# EAGLE design IOIO (EAGLE 6.3)
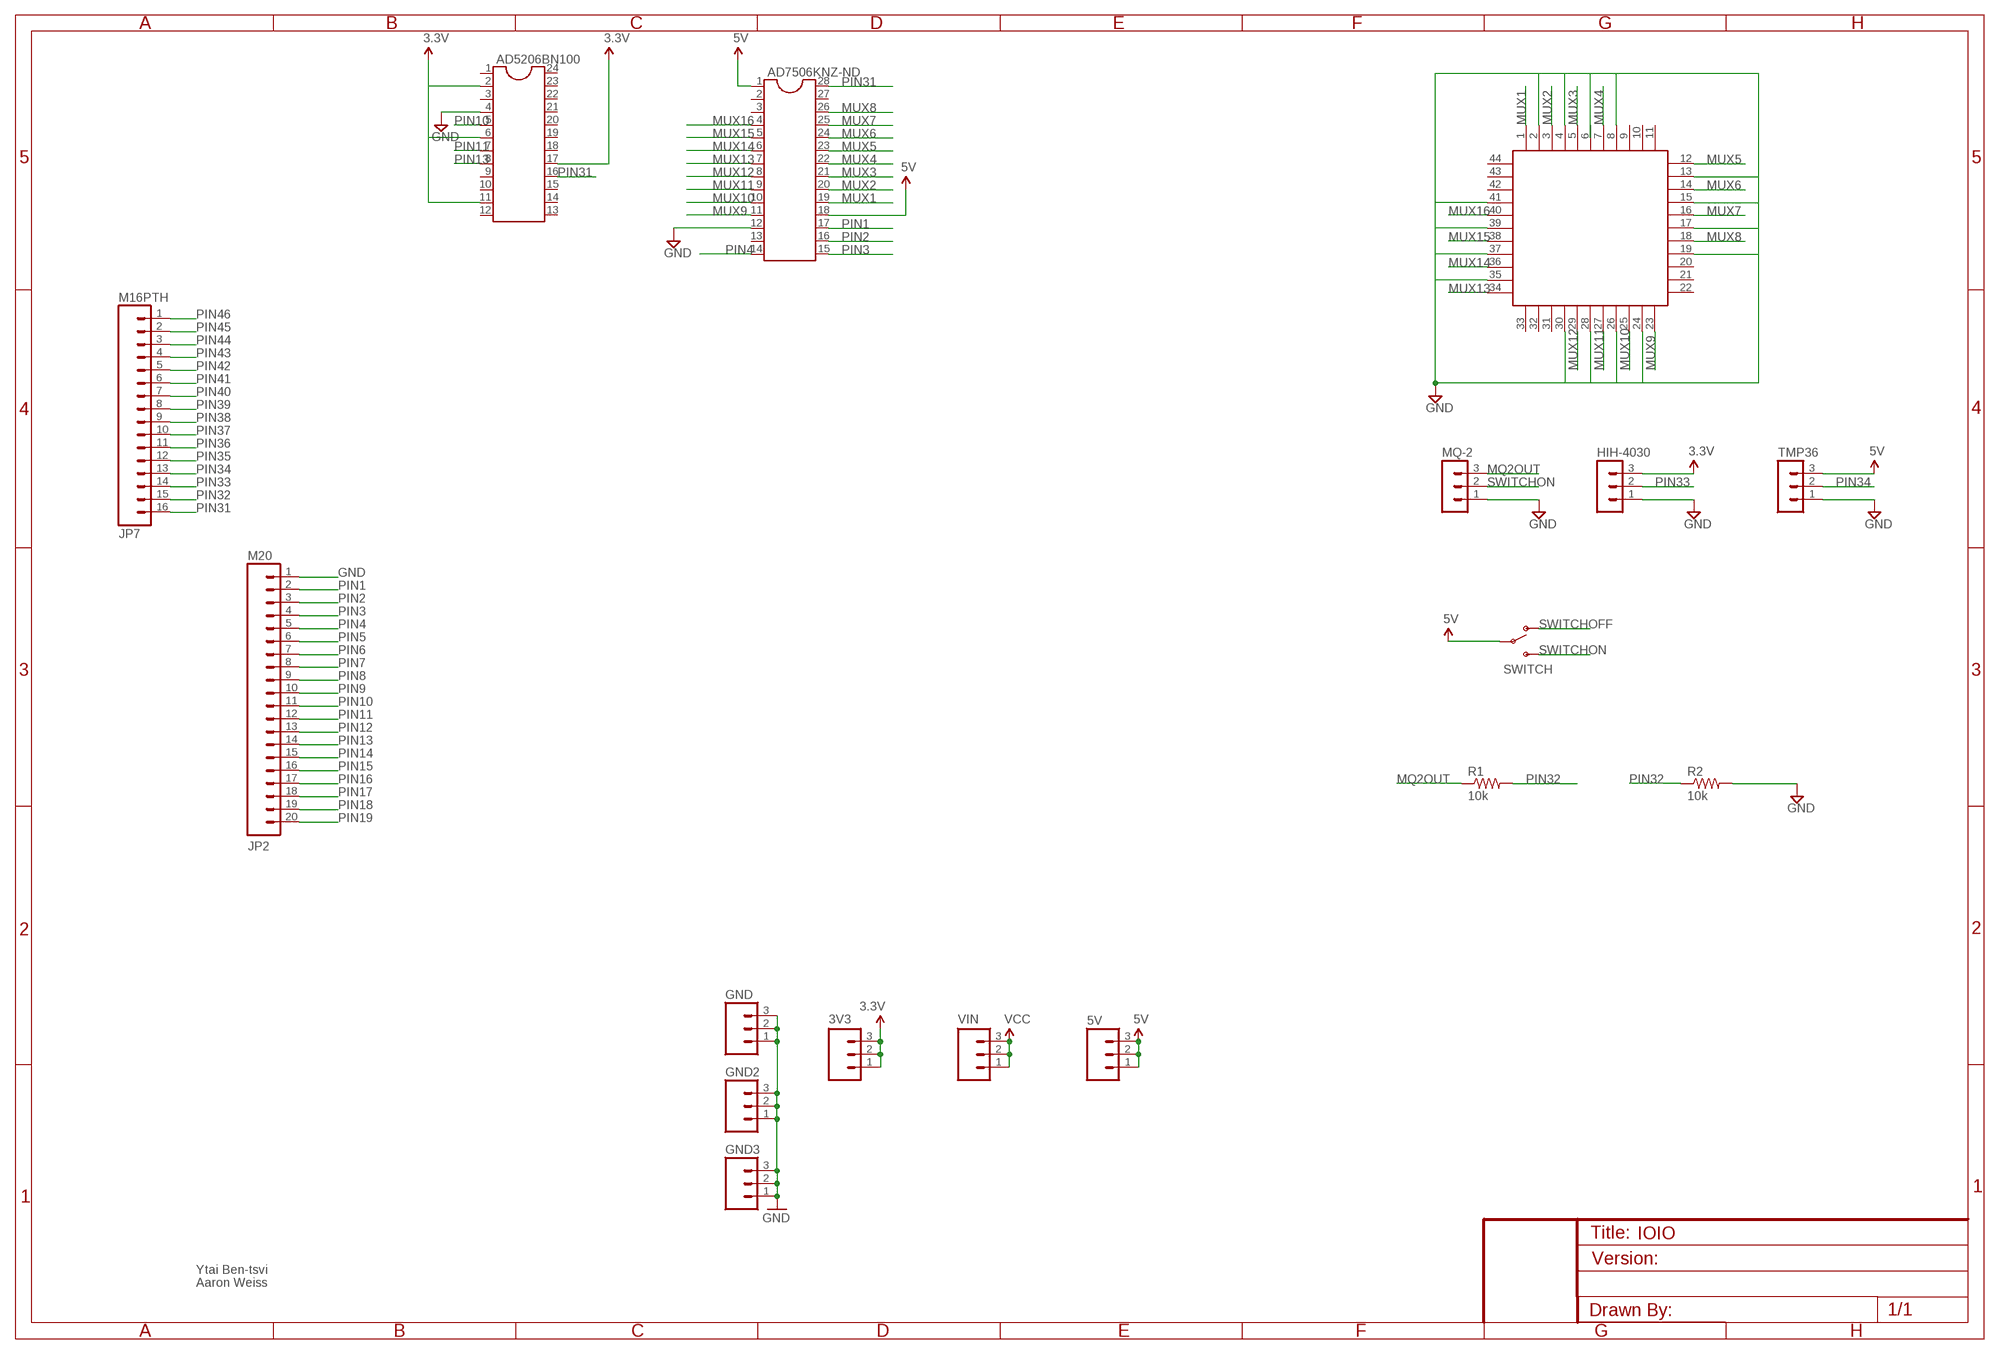
[diagram p0: schematic, sheet 1]

## Parts
3V3  M03PTH  [1X03]
5V  M03PTH  [1X03]
AD5206BN100  DIL24-3  [DIL24-3]
AD7506KNZ-ND  DIL28  [DIL28-6]
GND  M03PTH  [1X03]
GND2  M03PTH  [1X03]
GND3  M03PTH  [1X03]
HIH-4030  MA03-1  [MA03-1]
JP2  M20  [1X20]
JP7  M16PTH  [1X16]
MQ-2  MA03-1  [MA03-1]
R1  10k  R-US_0207/7  [0207/7]
R2  10k  R-US_0207/7  [0207/7]
SWITCH  SWITCH-SPSTPTH  [SWITCH-SPDT]
TMP36  MA03-1  [MA03-1]
U$1  S44  [S44]
VIN  M03PTH  [1X03]

## Nets
3.3V: 3V3.1 3V3.2 3V3.3 AD5206BN100.2 AD5206BN100.6 AD5206BN100.11 AD5206BN100.17 HIH-4030.3
5V: 5V.1 5V.2 5V.3 AD7506KNZ-ND.1 AD7506KNZ-ND.18 SWITCH.2(P) TMP36.3
GND: AD5206BN100.4 AD7506KNZ-ND.12 GND2.1 GND2.2 GND2.3 GND3.1 GND3.2 GND3.3 GND.1 GND.2 GND.3 HIH-4030.1 JP2.1 MQ-2.1 R2.2 TMP36.1 U$1.2 U$1.4 U$1.8 U$1.13 U$1.15 U$1.17 U$1.19 U$1.24 U$1.26 U$1.28 U$1.30 U$1.35 U$1.37 U$1.39 U$1.41
MQ2OUT: MQ-2.3 R1.1
MUX1: AD7506KNZ-ND.19 U$1.1
MUX2: AD7506KNZ-ND.20 U$1.3
MUX3: AD7506KNZ-ND.21 U$1.5
MUX4: AD7506KNZ-ND.22 U$1.7
MUX5: AD7506KNZ-ND.23 U$1.12
MUX6: AD7506KNZ-ND.24 U$1.14
MUX7: AD7506KNZ-ND.25 U$1.16
MUX8: AD7506KNZ-ND.26 U$1.18
MUX9: AD7506KNZ-ND.11 U$1.23
MUX10: AD7506KNZ-ND.10 U$1.25
MUX11: AD7506KNZ-ND.9 U$1.27
MUX12: AD7506KNZ-ND.8 U$1.29
MUX13: AD7506KNZ-ND.7 U$1.34
MUX14: AD7506KNZ-ND.6 U$1.36
MUX15: AD7506KNZ-ND.5 U$1.38
MUX16: AD7506KNZ-ND.4 U$1.40
PIN1: AD7506KNZ-ND.17 JP2.2
PIN2: AD7506KNZ-ND.16 JP2.3
PIN3: AD7506KNZ-ND.15 JP2.4
PIN4: AD7506KNZ-ND.14 JP2.5
PIN5: JP2.6
PIN6: JP2.7
PIN7: JP2.8
PIN8: JP2.9
PIN9: JP2.10
PIN10: AD5206BN100.5 JP2.11
PIN11: AD5206BN100.7 JP2.12
PIN12: JP2.13
PIN13: AD5206BN100.8 JP2.14
PIN14: JP2.15
PIN15: JP2.16
PIN16: JP2.17
PIN17: JP2.18
PIN18: JP2.19
PIN19: JP2.20
PIN31: AD5206BN100.16 AD7506KNZ-ND.28 JP7.16
PIN32: JP7.15 R1.2 R2.1
PIN33: HIH-4030.2 JP7.14
PIN34: JP7.13 TMP36.2
PIN35: JP7.12
PIN36: JP7.11
PIN37: JP7.10
PIN38: JP7.9
PIN39: JP7.8
PIN40: JP7.7
PIN41: JP7.6
PIN42: JP7.5
PIN43: JP7.4
PIN44: JP7.3
PIN45: JP7.2
PIN46: JP7.1
SWITCHOFF: SWITCH.1(O)
SWITCHON: MQ-2.2 SWITCH.3(S)
VCC: VIN.1 VIN.2 VIN.3
Unconnected: AD5206BN100.1 AD5206BN100.3 AD5206BN100.9 AD5206BN100.10 AD5206BN100.12 AD5206BN100.13 AD5206BN100.14 AD5206BN100.15 AD5206BN100.18 AD5206BN100.19 AD5206BN100.20 AD5206BN100.21 AD5206BN100.22 AD5206BN100.23 AD5206BN100.24 AD7506KNZ-ND.2 AD7506KNZ-ND.3 AD7506KNZ-ND.13 AD7506KNZ-ND.27 U$1.6 U$1.9 U$1.10 U$1.11 U$1.20 U$1.21 U$1.22 U$1.31 U$1.32 U$1.33 U$1.42 U$1.43 U$1.44

## Notes on the sheet
- Ytai Ben-tsvi
- Aaron Weiss

## Library data of the parts
3V3 5V GND GND2 GND3 VIN = SparkFun:M03: Header 3 Standard 3-pin 0.1" header. Use with straight break away headers (SKU : PRT-00116), right angle break away headers (PRT-00553), swiss pins (PRT-00743), machine pins (PRT-00117), and female headers (PRT-00115). Molex polarized connector foot print use with SKU : PRT-08232 with associated crimp pins and housings.
AD5206BN100 = ic-package:DIL24: Dual In Line
AD7506KNZ-ND = ic-package:DIL28: Dual In Line
HIH-4030 MQ-2 TMP36 = con-lstb:MA03-1: PIN HEADER; OC_FARNELL: unknown; OC_NEWARK: unknown
JP2 = SparkFun-Connectors:M20: 1x20 .1" header This is just like the LOCK variant in that the holes are staggared by 5 mil, but except for the last two holes. They are not altered from the "standard" footprint layout. This is used for a special purpose on the layout of our Graphic LCD Backpack. Make sure you want to use this device before selecting it for you project!
JP7 = SparkFun-Connectors:M16: 1x16 .1" header
R1 R2 = rcl:R-US_: RESISTOR, American symbol
SWITCH = SparkFun:SWITCH-SPST: SPST Switch Simple slide switch. Spark Fun Electronics SKU : COM-00102
U$1 = plcc-socket:S44: 44-pin PLCC through-hole socket

## Board
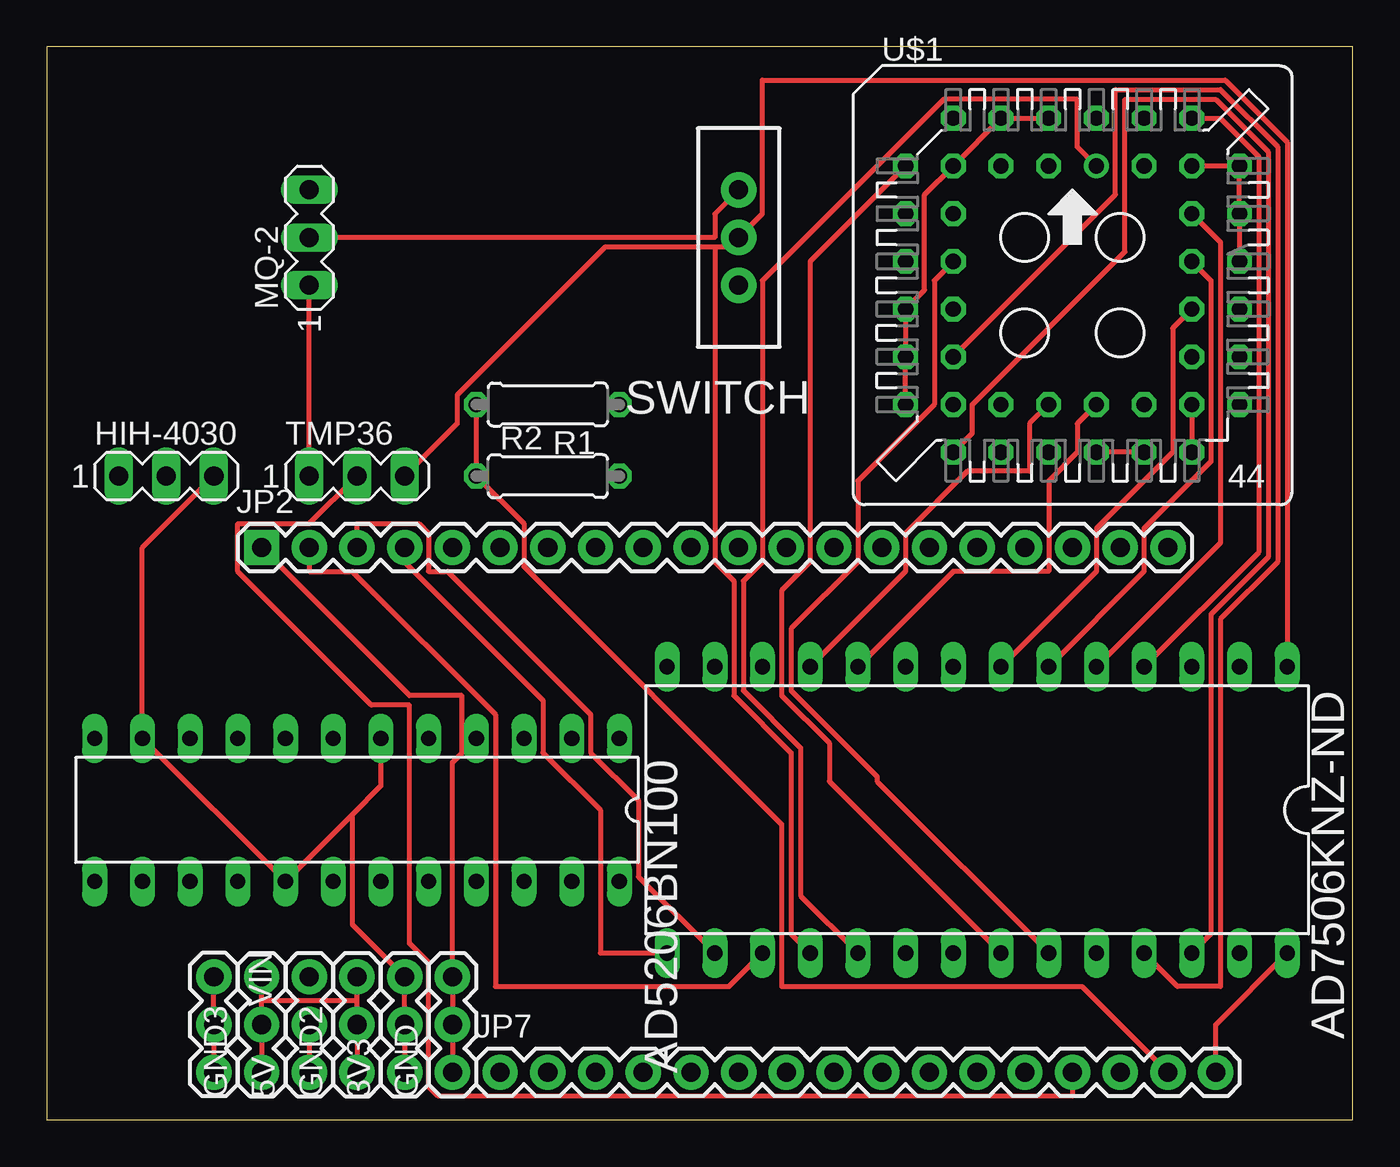
[diagram p1: board, top side]
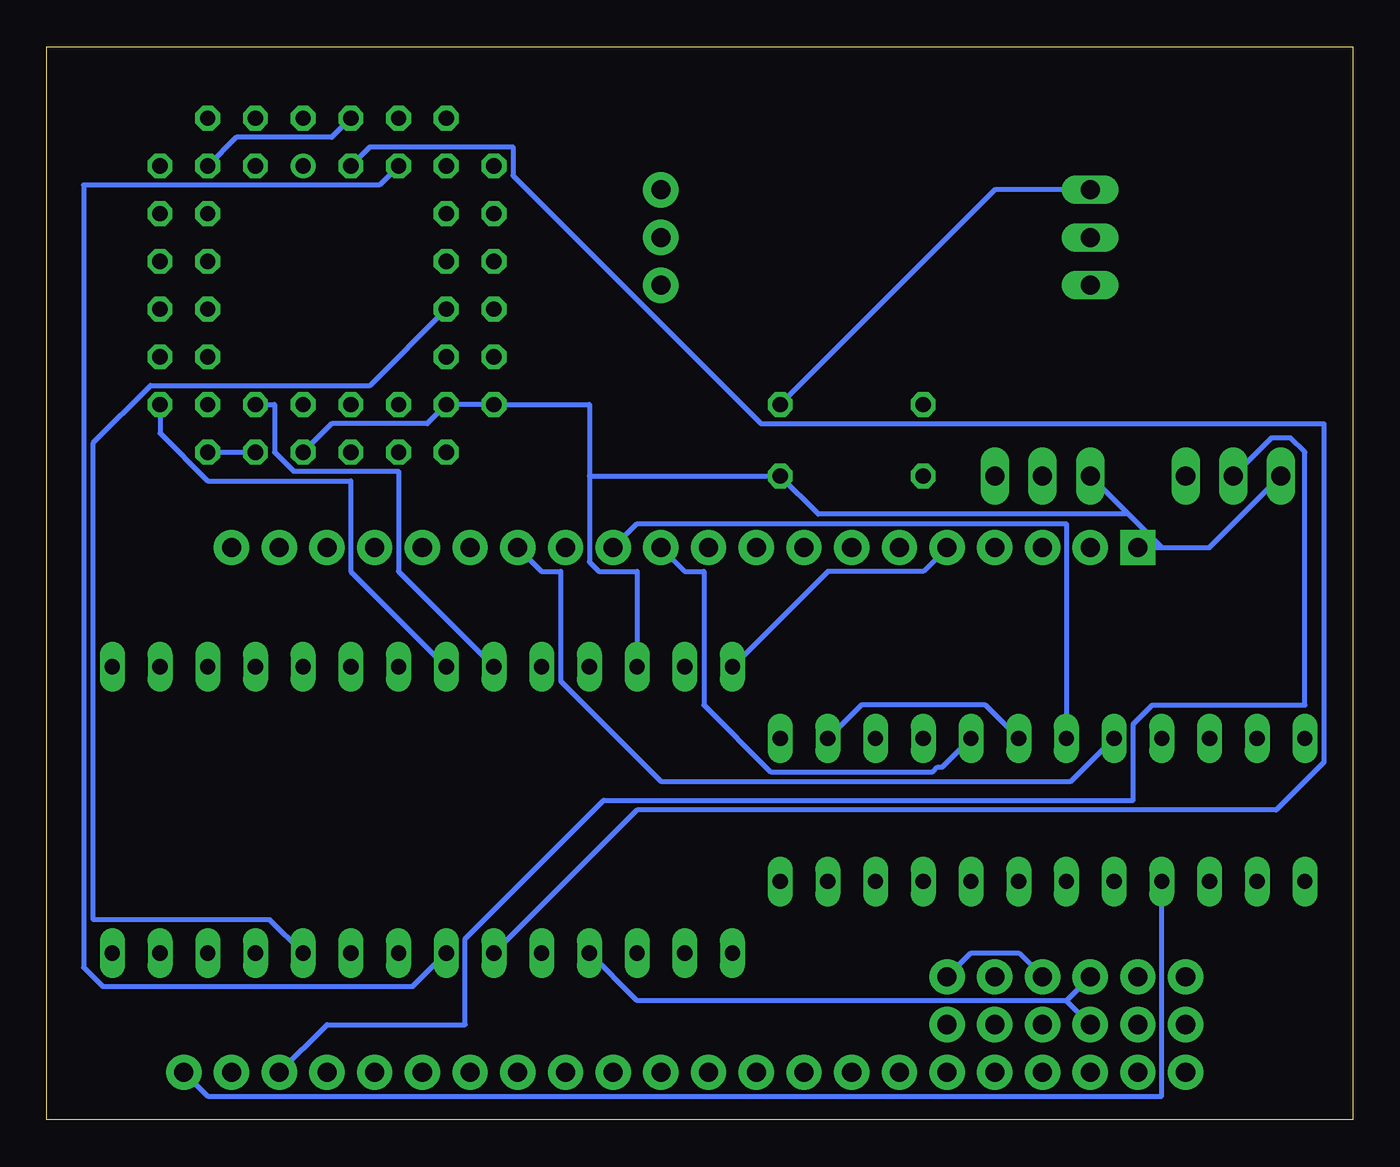
[diagram p2: board, bottom side, seen from below]

Size 69.52 x 57.14 mm. Coordinates in mm from the lower left corner, seen from the top.
Outline: 0,0 69.52,0 69.52,57.14 0,57.14 0,0
Copper layers (1*16): Top 0.035mm / dielectric 1.5mm / Bottom 0.035mm
Design rules "default": minimum track width 10mil, minimum drill 24mil, track to track 8mil, track to pad 8mil, pad to pad 8mil, via to via 8mil, smd to smd 8mil, copper to edge 40mil, drill to drill 8mil, minimum pad ring 10mil, minimum via ring 8mil, stop-mask expansion 4mil, vias tented up to drill 0mil, thermal gap 10mil

### Footprints (pad centres in the part's own frame; a part is rotated, then mirrored left to right if it is on the bottom)
1X03 = drill 1.016 pad 1.88: 1 0,0; 2 2.54,0; 3 5.08,0
DIL24-3 = drill 0.813 long: 1 -13.97,-3.81; 2 -11.43,-3.81; 3 -8.89,-3.81; 4 -6.35,-3.81; 5 -3.81,-3.81; 6 -1.27,-3.81; 7 1.27,-3.81; 8 3.81,-3.81; 9 6.35,-3.81; 10 8.89,-3.81; 11 11.43,-3.81; 12 13.97,-3.81; 13 13.97,3.81; 14 11.43,3.81; 15 8.89,3.81; 16 6.35,3.81; 17 3.81,3.81; 18 1.27,3.81; 19 -1.27,3.81; 20 -3.81,3.81; 21 -6.35,3.81; 22 -8.89,3.81; 23 -11.43,3.81; 24 -13.97,3.81
DIL28-6 = drill 0.813 long: 1 -16.51,-7.62; 2 -13.97,-7.62; 3 -11.43,-7.62; 4 -8.89,-7.62; 5 -6.35,-7.62; 6 -3.81,-7.62; 7 -1.27,-7.62; 8 1.27,-7.62; 9 3.81,-7.62; 10 6.35,-7.62; 11 8.89,-7.62; 12 11.43,-7.62; 13 13.97,-7.62; 14 16.51,-7.62; 15 16.51,7.62; 16 13.97,7.62; 17 11.43,7.62; 18 8.89,7.62; 19 6.35,7.62; 20 3.81,7.62; 21 1.27,7.62; 22 -1.27,7.62; 23 -3.81,7.62; 24 -6.35,7.62; 25 -8.89,7.62; 26 -11.43,7.62; 27 -13.97,7.62; 28 -16.51,7.62
MA03-1 = drill 1.016 long: 1 -2.54,0; 2 0,0; 3 2.54,0
1X20 = drill 1.016 pad 1.88 square: 1 0,0 | drill 1.016 pad 1.88: 2 2.54,0; 3 5.08,0; 4 7.62,0; 5 10.16,0; 6 12.7,0; 7 15.24,0; 8 17.78,0; 9 20.32,0; 10 22.86,0; 11 25.4,0; 12 27.94,0; 13 30.48,0; 14 33.02,0; 15 35.56,0; 16 38.1,0; 17 40.64,0; 18 43.18,0; 19 45.72,0; 20 48.26,0
1X16 = drill 1.016 pad 1.88: 1 0,0; 2 2.54,0; 3 5.08,0; 4 7.62,0; 5 10.16,0; 6 12.7,0; 7 15.24,0; 8 17.78,0; 9 20.32,0; 10 22.86,0; 11 25.4,0; 12 27.94,0; 13 30.48,0; 14 33.02,0; 15 35.56,0; 16 38.1,0
0207/7 = drill 0.813 octagon: 1 -3.81,0; 2 3.81,0
SWITCH-SPDT = drill 1.016 pad 1.88: 1 0,2.54; 2 0,0; 3 0,-2.54
S44 = drill 0.813: 1 1.27,6.35 | drill 0.813 octagon: 2 -1.27,8.89; 3 -1.27,6.35; 4 -3.81,8.89; 5 -3.81,6.35; 6 -6.35,8.89; 7 -8.89,6.35; 8 -6.35,6.35; 9 -8.89,3.81; 10 -6.35,3.81; 11 -8.89,1.27; 12 -6.35,1.27; 13 -8.89,-1.27; 14 -6.35,-1.27; 15 -8.89,-3.81; 16 -6.35,-3.81; 17 -8.89,-6.35; 18 -6.35,-8.89; 19 -6.35,-6.35; 20 -3.81,-8.89; 21 -3.81,-6.35; 22 -1.27,-8.89; 23 -1.27,-6.35; 24 1.27,-8.89; 25 1.27,-6.35; 26 3.81,-8.89; 27 3.81,-6.35; 28 6.35,-8.89; 29 8.89,-6.35; 30 6.35,-6.35; 31 8.89,-3.81; 32 6.35,-3.81; 33 8.89,-1.27; 34 6.35,-1.27; 35 8.89,1.27; 36 6.35,1.27; 37 8.89,3.81; 38 6.35,3.81; 39 8.89,6.35; 40 6.35,8.89; 41 6.35,6.35; 42 3.81,8.89; 43 3.81,6.35; 44 1.27,8.89

### Placement (x,y rotation side)
3V3  19.05,2.54 90 top
5V  13.97,2.54 90 top
AD5206BN100  16.51,16.51 180 top
AD7506KNZ-ND  49.53,16.51 180 top
GND  21.59,2.54 90 top
GND2  16.51,2.54 90 top
GND3  11.43,2.54 90 top
HIH-4030  6.35,34.29 0 top
JP2  11.43,30.48 0 top
JP7  24.13,2.54 0 top
MQ-2  13.97,46.99 90 top
R1  26.67,38.1 180 top
R2  26.67,34.29 0 top
SWITCH  36.83,46.99 180 top
TMP36  16.51,34.29 0 top
U$1  54.61,44.45 0 top
VIN  8.89,7.62 270 top

### Tracks (layer width: path | path; a pad name or v marks a point on that pad's centre or on a via)
3.3V
  Top 0.254: 3V3.1 3V3.2 3V3.3 16.26,10.41 16.26,16.26 | 16.26,16.26 17.78,17.78 AD5206BN100.6 | 16.26,16.26 AD5206BN100.17 AD5206BN100.11 5.08,30.48 HIH-4030.3
  Bottom 0.254: AD5206BN100.2 26.16,22.1 19.56,22.1 AD5206BN100.6
5V
  Top 0.254: 5V.2 5V.1 | AD7506KNZ-ND.1 66.04,52.07 62.74,55.37 38.1,55.37 38.1,48.26 SWITCH.2 36.83,46.48 35.56,46.48 | TMP36.3 21.84,37.08 21.84,38.61 29.72,46.48 35.56,46.48 | AD7506KNZ-ND.18 39.62,9.91 39.62,19.56 36.58,22.61 36.58,28.7 35.56,29.72 35.56,46.48
  Bottom 0.254: AD7506KNZ-ND.18 38.1,6.35 15.24,6.35 | 5V.3 15.24,6.35 | 15.24,6.35 5V.2
GND
  Top 0.254: U$1.41 U$1.39 U$1.37 U$1.35 | U$1.2 U$1.4 U$1.8 46.74,49.28 46.74,44.2 U$1.13 U$1.15 U$1.17 | U$1.26 U$1.24 | U$1.30 U$1.28 | TMP36.1 MQ-2.1 | GND3.1 GND3.2 11.43,6.35 | 11.43,6.35 GND3.3 | GND2.1 GND2.2 16.51,6.35 | 16.51,6.35 GND2.3 | 16.51,6.35 11.43,6.35 | GND.1 GND.2 GND.3 21.59,19.05 22.1,19.56 | 22.1,19.56 AD5206BN100.4 | JP2.1 19.3,22.61 22.1,22.61 22.1,19.56
  Bottom 0.254: U$1.41 59.44,52.32 54.36,52.32 U$1.2 | U$1.28 U$1.26 | AD7506KNZ-ND.12 38.1,29.21 40.13,29.21 40.64,29.72 40.64,34.29 | 40.64,34.29 40.64,38.1 U$1.17 U$1.19 49.28,37.08 54.36,37.08 U$1.24 | 40.64,34.29 R2.2 28.45,32.26 11.94,32.26 | HIH-4030.1 7.62,30.48 10.16,30.48 | JP2.1 10.16,30.48 | 10.16,30.48 11.94,32.26 | 11.94,32.26 TMP36.1 | GND2.3 17.78,8.89 20.32,8.89 GND.3
MQ2OUT
  Bottom 0.254: R1.1 19.05,49.53 MQ-2.3
MUX1
  Top 0.254: AD7506KNZ-ND.19 40.13,11.94 40.13,19.81 37.08,22.86 37.08,28.7 38.1,29.72 38.1,44.7 47.75,54.36 54.86,54.36 54.86,51.82 U$1.1
MUX2
  Bottom 0.254: AD7506KNZ-ND.20 38.1,16.51 4.06,16.51 1.52,19.05 1.52,37.08 31.5,37.08 44.7,50.29 44.7,51.82 52.32,51.82 U$1.3
MUX3
  Bottom 0.254: AD7506KNZ-ND.21 50.04,7.11 66.55,7.11 67.56,8.13 67.56,49.78 51.82,49.78 U$1.5
MUX4
  Top 0.254: AD7506KNZ-ND.22 41.66,18.03 41.66,20.07 39.12,22.61 39.12,28.19 40.64,29.72 40.64,45.72 U$1.7
MUX5
  Top 0.254: AD7506KNZ-ND.23 44.2,18.03 44.2,18.29 39.62,22.86 39.62,26.16 43.18,29.72 43.18,34.04 47.24,38.1 47.24,44.7 U$1.12
MUX6
  Bottom 0.254: U$1.14 52.32,39.12 64.01,39.12 67.06,36.07 67.06,10.67 57.66,10.67 AD7506KNZ-ND.24
MUX7
  Top 0.254: AD7506KNZ-ND.25 60.2,7.11 62.48,7.11 62.48,26.67 65.53,29.72 65.53,51.82 62.48,54.86 56.9,54.86 56.9,49.28 U$1.16
MUX8
  Top 0.254: AD7506KNZ-ND.26 61.98,9.91 61.98,26.92 65.02,29.97 65.02,51.56 62.23,54.36 57.4,54.36 57.4,46.23 49.28,38.1 49.28,36.58 U$1.18
MUX9
  Top 0.254: AD7506KNZ-ND.11 45.72,29.21 45.72,31.24 49.02,34.54 52.32,34.54 52.32,37.08 U$1.23
MUX10
  Top 0.254: AD7506KNZ-ND.10 48.26,29.21 53.34,29.21 53.34,34.04 54.86,35.56 54.86,37.08 U$1.25
MUX11
  Bottom 0.254: AD7506KNZ-ND.9 50.8,29.21 50.8,34.54 56.39,34.54 57.4,35.56 57.4,38.1 U$1.27
MUX12
  Bottom 0.254: AD7506KNZ-ND.8 53.34,29.21 53.34,34.04 60.96,34.04 63.5,36.58 U$1.29
MUX13
  Top 0.254: AD7506KNZ-ND.7 55.88,29.21 55.88,31.5 59.94,35.56 59.94,42.16 U$1.34
MUX14
  Top 0.254: AD7506KNZ-ND.6 58.42,29.21 58.42,31.5 61.98,35.05 61.98,44.7 U$1.36
MUX15
  Top 0.254: AD7506KNZ-ND.5 62.48,30.73 62.48,46.74 U$1.38
MUX16
  Top 0.254: AD7506KNZ-ND.4 64.52,30.23 64.52,51.31 62.48,53.34 U$1.40
PIN1
  Top 0.254: AD7506KNZ-ND.17 36.32,7.11 23.88,7.11 23.88,21.59 16.26,29.21 13.97,29.21 JP2.2
PIN2
  Top 0.254: AD7506KNZ-ND.16 31.5,12.95 31.5,17.02 28.96,19.56 28.96,21.59 21.34,29.21 20.32,29.21 20.32,31.24 19.81,31.75 16.51,31.75 JP2.3
PIN3
  Top 0.254: AD7506KNZ-ND.15 29.46,8.89 29.46,16.51 26.42,19.56 26.42,22.35 19.05,29.72 JP2.4
PIN4
  Bottom 0.254: AD7506KNZ-ND.14 27.94,29.21 22.86,29.21 JP2.5
PIN10
  Bottom 0.254: AD5206BN100.5 21.84,18.8 22.1,18.8 22.35,18.54 30.99,18.54 34.54,22.1 34.54,29.21 35.56,29.21 JP2.11
PIN11
  Bottom 0.254: AD5206BN100.7 15.24,31.75 38.1,31.75 JP2.12
PIN13
  Bottom 0.254: AD5206BN100.8 14.99,18.03 36.83,18.03 42.16,23.37 42.16,29.21 43.18,29.21 JP2.14
PIN31
  Top 0.254: AD7506KNZ-ND.28 62.23,5.08 JP7.16
  Bottom 0.254: AD5206BN100.16 10.16,1.27 60.96,1.27 JP7.16
PIN32
  Top 0.254: R1.2 R2.1 25.4,31.75 25.4,29.46 39.12,15.75 39.12,7.11 55.12,7.11 JP7.15
PIN33
  Bottom 0.254: HIH-4030.2 4.32,36.32 3.3,36.32 2.54,35.56 2.54,22.1 10.67,22.1 11.68,21.08 11.68,17.02 39.88,17.02 47.24,9.65 47.24,5.08 54.61,5.08 JP7.14
PIN34
  Top 0.254: TMP36.2 13.97,31.75 10.16,31.75 10.16,29.21 17.27,22.1 19.3,22.1 19.3,9.4 20.32,8.38 20.32,1.78 20.83,1.27 54.61,1.27 JP7.13
SWITCHON
  Top 0.254: MQ-2.2 35.56,46.99 35.56,48.26 SWITCH.3
VCC
  Top 0.254: VIN.3 VIN.2 VIN.1